# EAGLE schematic relay (EAGLE 8.7.1)
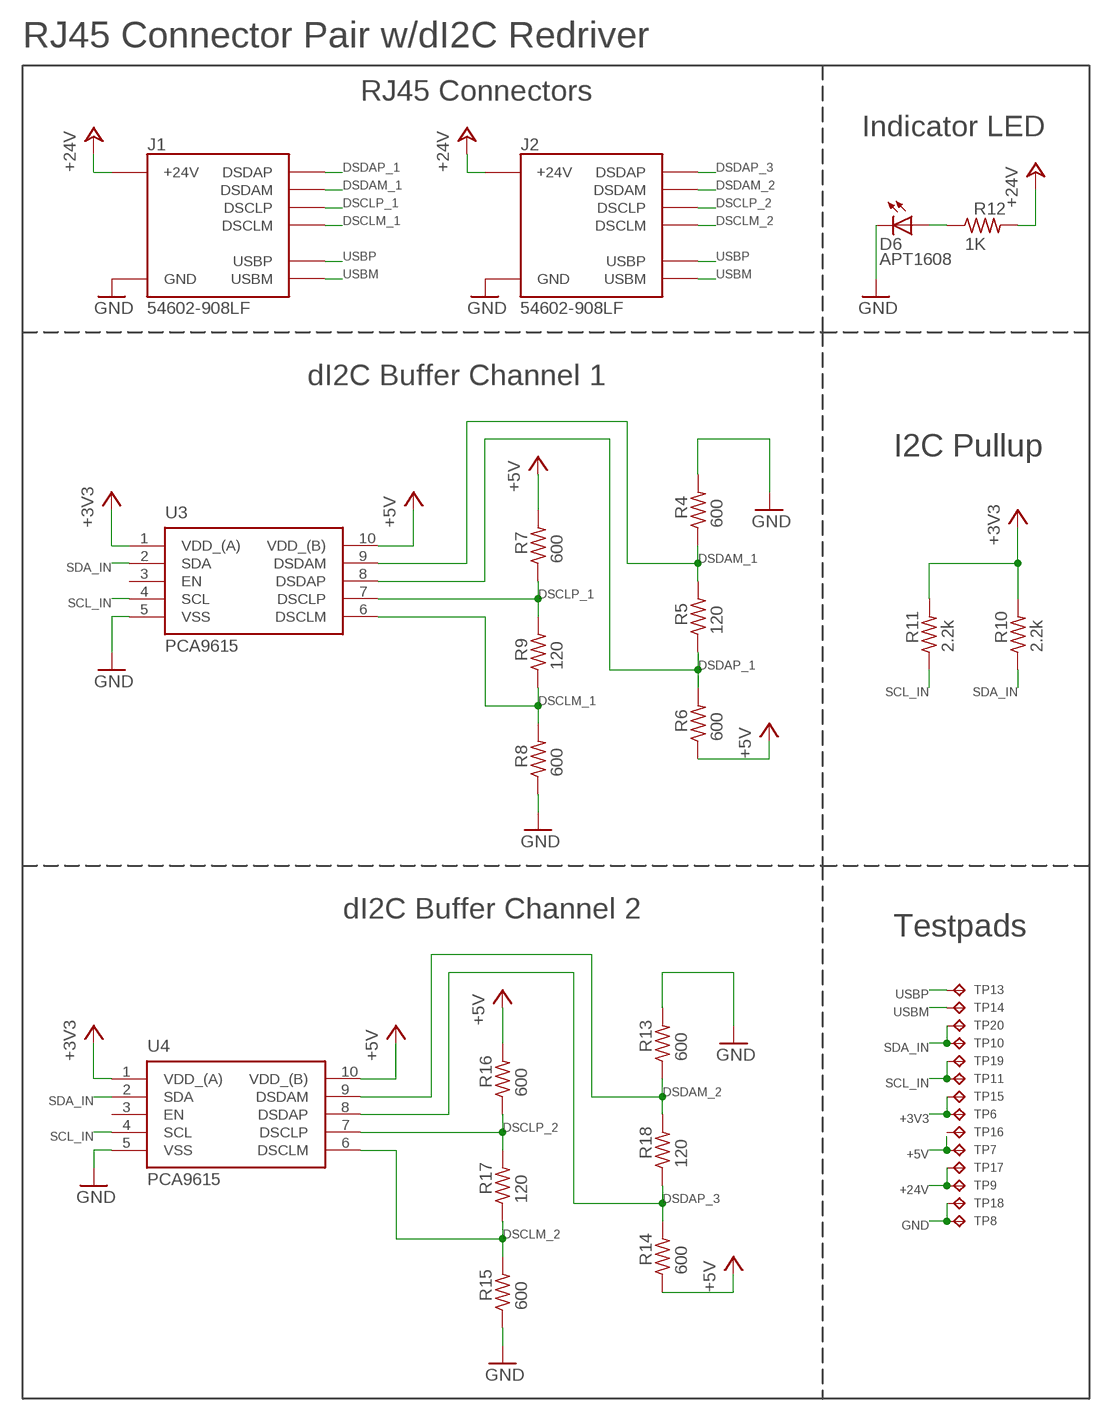
[diagram p0: schematic, sheet 1, part 1 of 2]
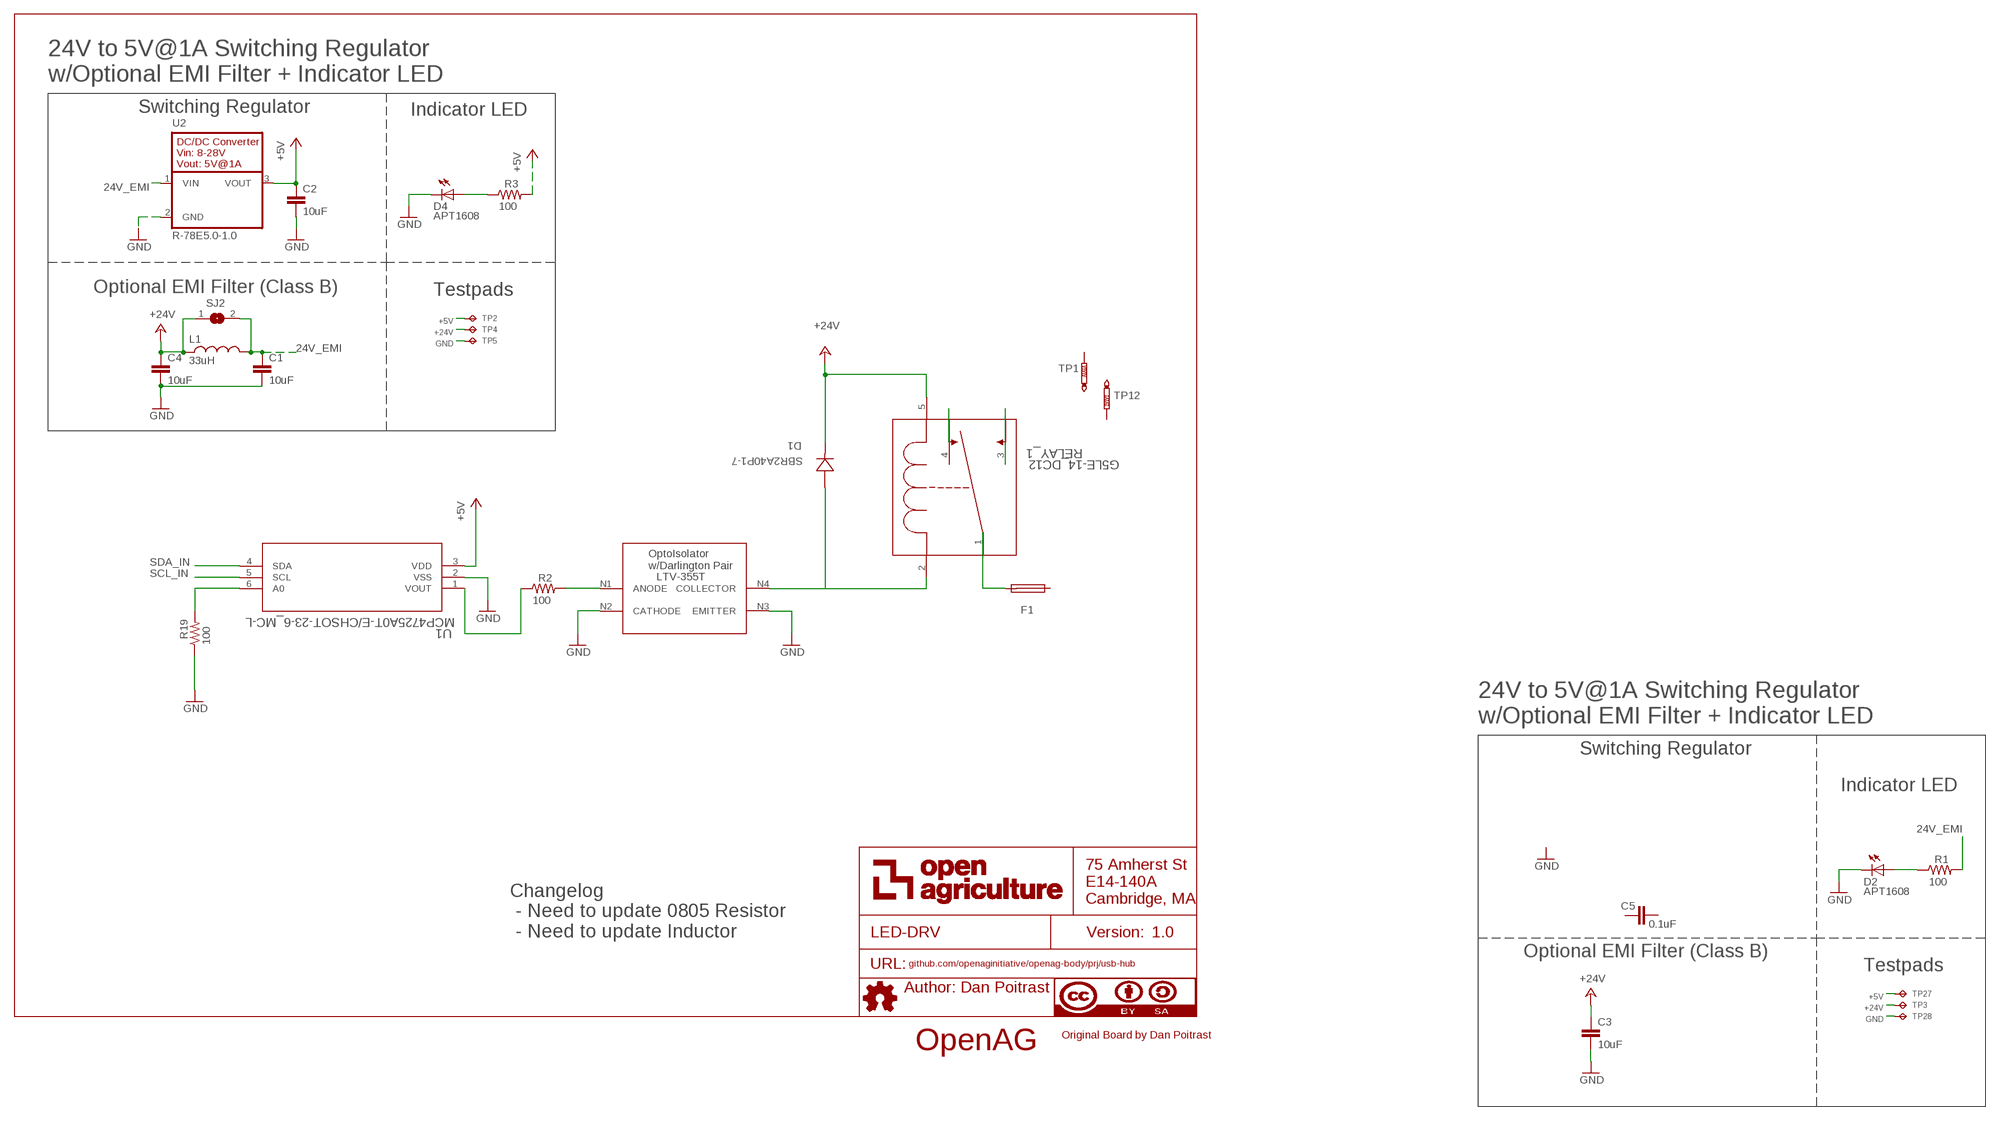
[diagram p1: schematic, sheet 1, part 2 of 2]

## Parts
C1  10uF  10UF-GMK212BBJ106KG-T  [C0805]
C2  10uF  10UF-GMK212BBJ106KG-T  [C0805]
C3  10uF  10UF-GMK212BBJ106KG-T  [C0805]
C4  10uF  10UF-GMK212BBJ106KG-T  [C0805]
C5  0.1uF  0.1UF-C0603C104K5RACTU  [C0603]
D1  SBR2A40P1-7  [POWERDI123]
D2  APT1608  APT1608CGCK  [CHIPLED_0603]
D4  APT1608  APT1608CGCK  [CHIPLED_0603]
D6  APT1608  APT1608CGCK  [CHIPLED_0603]
F1  GSH15  [GSH15]
J1  54602-908LF  RJ45-DI2C-USB-54602-908LFPTH  [RJ45-DI2C-USB-54602-908LF]
J2  54602-908LF  RJ45-DI2C-USB-54602-908LFPTH  [RJ45-DI2C-USB-54602-908LF]
L1  33uH  33UH-29333C  [29333C]
R1  100  100OHM-RC0603JR-07100RL  [RC0603N]
R2  100  100OHM-RC0603JR-07100RL  [RC0603N]
R3  100  100OHM-RC0603JR-07100RL  [RC0603N]
R4  600  600OHM-RC0603FR-07604RL  [RC0603N]
R5  120  120OHM-RC0603FR-07120RL  [RC0603N]
R6  600  600OHM-RC0603FR-07604RL  [RC0603N]
R7  600  600OHM-RC0603FR-07604RL  [RC0603N]
R8  600  600OHM-RC0603FR-07604RL  [RC0603N]
R9  120  120OHM-RC0603FR-07120RL  [RC0603N]
R10  2.2k  2.2K-RC0603JR-072K2L  [RC0603N]
R11  2.2k  2.2K-RC0603JR-072K2L  [RC0603N]
R12  1K  1K-ERJ-PB3D1001V  [RC0603N]
R13  600  600OHM-RC0603FR-07604RL  [RC0603N]
R14  600  600OHM-RC0603FR-07604RL  [RC0603N]
R15  600  600OHM-RC0603FR-07604RL  [RC0603N]
R16  600  600OHM-RC0603FR-07604RL  [RC0603N]
R17  120  120OHM-RC0603FR-07120RL  [RC0603N]
R18  120  120OHM-RC0603FR-07120RL  [RC0603N]
R19  100  100OHM-RC0603JR-07100RL  [RC0603N]
RELAY_1  G5LE-14_DC12  [RELAY_G5LE-1]
SJ2  EMI-BYPASS  [EMI-BYPASS]
TP1  PTR1B2,54  [B2,54]
TP2  TPTP06R  [TP06R]
TP3  TPTP06R  [TP06R]
TP4  TPTP06R  [TP06R]
TP5  TPTP06R  [TP06R]
TP6  TPTP04R  [TP04R]
TP7  TPTP04R  [TP04R]
TP8  TPTP04R  [TP04R]
TP9  TPTP04R  [TP04R]
TP10  TPTP04R  [TP04R]
TP11  TPTP04R  [TP04R]
TP12  PTR1B2,54  [B2,54]
TP13  TPTP04R  [TP04R]
TP14  TPTP04R  [TP04R]
TP15  TPTP04R  [TP04R]
TP16  TPTP04R  [TP04R]
TP17  TPTP04R  [TP04R]
TP18  TPTP04R  [TP04R]
TP19  TPTP04R  [TP04R]
TP20  TPTP04R  [TP04R]
TP27  TPTP06R  [TP06R]
TP28  TPTP06R  [TP06R]
U1  MCP4725A0T-E/CHSOT-23-6_MC-L  [SOT-23-6_MC-L]
U2  R-78E5.0-1.0  [R-78E5.0-1.0]
U3  PCA9615  PCA9615DPJ  [SOP50P490X110-10N]
U4  PCA9615  PCA9615DPJ  [SOP50P490X110-10N]
U$6  AUTHOR  [AUTHOR]
U$7  TITLE  [TITLE]
U$9  LTV-355T  [LTV-355T]

## Nets
24V_EMI: C1.1 L1.2 R1.2 SJ2.2 U2.1(VIN)
+3V3: R10.2 R11.2 TP6.1(TP) TP15.1(TP) U3.1(VDD_(A)) U4.1(VDD_(A))
+5V: C2.1 R3.2 R6.1 R7.2 R14.1 R16.2 TP2.TP TP7.1(TP) TP16.1(TP) TP27.TP U1.3(VDD) U2.3(VOUT) U3.10(VDD_(B)) U4.10(VDD_(B))
+24V: C3.1 C4.1 D1.- J1.24V(6)(+24V) J2.24V(6)(+24V) L1.1 R12.2 RELAY_1.5 SJ2.1 TP3.TP TP4.TP TP9.1(TP) TP17.1(TP)
DSCLM_1: J1.DSCLM(5)(DSCLM) R8.2 R9.1 U3.6(DSCLM)
DSCLM_2: J2.DSCLM(5)(DSCLM) R15.2 R17.1 U4.6(DSCLM)
DSCLP_1: J1.DSCLP(4)(DSCLP) R7.1 R9.2 U3.7(DSCLP)
DSCLP_2: J2.DSCLP(4)(DSCLP) R16.1 R17.2 U4.7(DSCLP)
DSDAM_1: J1.DSDAM(2)(DSDAM) R4.1 R5.2 U3.9(DSDAM)
DSDAM_2: J2.DSDAM(2)(DSDAM) R13.1 R18.2 U4.9(DSDAM)
DSDAP_1: J1.DSDAP(1)(DSDAP) R5.1 R6.2 U3.8(DSDAP)
DSDAP_3: J2.DSDAP(1)(DSDAP) R14.2 R18.1 U4.8(DSDAP)
GND: C1.2 C2.2 C3.2 C4.2 D2.C D4.C D6.C R4.2 R8.1 R13.2 R15.1 R19.1 TP5.TP TP8.1(TP) TP18.1(TP) TP28.TP U1.2(VSS) U2.2(GND) U3.5(VSS) U4.5(VSS) U$9.N2(CATHODE) U$9.N3(EMITTER)
N$4: RELAY_1.3
N$5: D1.+ RELAY_1.2 U$9.N4(COLLECTOR)
N$6: D2.A R1.1
N$11: F1.2 RELAY_1.1
N$27: R2.2 U$9.N1(ANODE)
N$31: R2.1 U1.1(VOUT)
N$32: R19.2 U1.6(A0)
N$33: D4.A R3.1
N$43: D6.A R12.1
SCL_IN: R11.1 TP11.1(TP) TP19.1(TP) U1.5(SCL) U3.4(SCL) U4.4(SCL)
SDA_IN: R10.1 TP10.1(TP) TP20.1(TP) U1.4(SDA) U3.2(SDA) U4.2(SDA)
USBM: J1.USBM(8)(USBM) J2.USBM(8)(USBM) TP14.1(TP)
USBP: J1.USBP(7)(USBP) J2.USBP(7)(USBP) TP13.1(TP)
Unconnected: C5.1 C5.2 F1.1 J1.GND(3)(GND) J2.GND(3)(GND) RELAY_1.4 TP1.TP TP12.TP U3.3(EN) U4.3(EN)

## Notes on the sheet
- 24V to 5V@1A Switching Regulator
  w/Optional EMI Filter + Indicator LED
- RJ45 Connector Pair w/dI2C Redriver
- Switching Regulator | Indicator LED
- RJ45 Connectors
- Indicator LED
- Optional EMI Filter (Class B) | Testpads
- dI2C Buffer Channel 1
- I2C Pullup
- LTV-355T
- dI2C Buffer Channel 2
- Testpads
- 24V to 5V@1A Switching Regulator
  w/Optional EMI Filter + Indicator LED
- Switching Regulator
- Indicator LED
- Changelog
   - Need to update 0805 Resistor
   - Need to update Inductor
- Optional EMI Filter (Class B)
- Testpads
- Original Board by Dan Poitrast
- OpenAG

## Library data of the parts
C1-C4 = openag-capacitors:10UF-GMK212BBJ106KG-T: CAP CER 10UF 35V X5R 0805 Description: 10µF ±10% 35V Ceramic Capacitor X5R 0805 (2012 Metric) Technical Specifications: Capacitance: 10µF Tolerance: ±10% Rated Voltage: 35V Temperature Coefficient: X5R Operating Temperature: -55°C ~ 85°C Package / Case: 0805 (2012 Metric) Datasheet(s): GMK212BBJ106KG-T Spec <http://ds.yuden.co.jp/TYCOMPAS/ut/detail.do?productNo=GMK212BBJ106KG-T&fileName=GMK212BBJ106KG-T_SS&mode=specSheetDownload> Vendor(s): Digikey: 587-4893-1-ND <https://www.digikey.com/product-detail/en/taiyo-yuden/GMK212BBJ106KG-T/587-4893-1-ND/6563736>; MANUFACTURER: Taiyo Yuden; MPN: GMK212BBJ106KG-T; VENDOR: Digikey; VLINK: https://www.digikey.com/product-detail/en/taiyo-yuden/GMK212BBJ106KG-T/587-4893-1-ND/6563736; VPN: 587-4893-1-ND
C5 = openag-capacitors:0.1UF-C0603C104K5RACTU: CAP CER 0.1UF 50V X7R 0603 Description: 0.1µF ±10% 50V Ceramic Capacitor X7R 0603 (1608 Metric) Technical Specifications: Capacitance: 0.1µF Tolerance: ±10% Rated Voltage: 50V Temperature Coefficient: X7R Operating Temperature: -55°C ~ 125°C Package / Case: 0603 (1608 Metric) Datasheet(s): X7R Dielectric, 6.3-250 VDC <https://search.kemet.com/component-edge/download/datasheet/C0603C104K5RACTU.pdf> Vendor(s): Digikey: 399-5089-1-ND <https://www.digikey.com/product-detail/en/kemet/C0603C104K5RACTU/399-5089-1-ND/1465623>; MANUFACTURER: Kemet; MPN: C0603C104K5RACTU; VENDOR: Digikey; VLINK: https://www.digikey.com/product-detail/en/kemet/C0603C104K5RACTU/399-5089-1-ND/1465623; VPN: 399-5089-1-ND
D1 = openag-diodes:SBR2A40P1-7: DIODE SBR 40V 2A POWERDI123 Description: Diode Super Barrier 40V 2A Surface Mount PowerDI™ 123 Technical Specifications: Diode Type: Super Barrier Voltage - DC Reverse (Vr) (Max): 40V Current - Average Rectified (Io): 2A Voltage - Forward (Vf) (Max) @ If: 500mV @ 2A Speed: Standard Recovery >500ns, > 200mA (Io) Current - Reverse Leakage @ Vr: 100µA @ 40V Mounting Type: Surface Mount Package / Case: POWERDI®123 Supplier Device Package: PowerDI™ 123 Operating Temperature - Junction: -65°C ~ 150°C Base Part Number: SBR2A40 Datasheet(s): SBR2A40P1 <https://www.diodes.com/assets/Datasheets/SBR2A40P1.pdf> Vendor(s): Digikey: SBR2A40P1DITR-ND <https://www.digikey.com/product-detail/en/diodes-incorporated/SBR2A40P1-7/SBR2A40P1DITR-ND/1681825>; MANUFACTURER: Diodes Incorporated; MPN: SBR2A40P1-7; VENDOR: Digikey; VLINK: https://www.digikey.com/product-detail/en/diodes-incorporated/SBR2A40P1-7/SBR2A40P1DITR-ND/1681825; VPN: SBR2A40P1DITR-ND
D2 D4 D6 = openag-diodes:APT1608CGCK: LED GREEN CLEAR 0603 SMD Description: Green 570nm LED Indication - Discrete 2.1V 0603 (1608 Metric) Technical Specifications: Color: Green Lens Color: Colorless Lens Transparency: Clear Millicandela Rating: 50mcd Lens Style/Size: Rectangle with Flat Top, 1.20mm x 0.80mm Voltage - Forward (Vf) (Typ): 2.1V Current - Test: 20mA Viewing Angle: 120° Mounting Type: Surface Mount Wavelength - Dominant: 570nm Wavelength - Peak: 574nm Package / Case: 0603 (1608 Metric) Supplier Device Package: Chip LED Size / Dimension: 1.60mm L x 0.80mm W Height (Max): 0.75mm Datasheet(s): APT1608CGCK <http://www.kingbrightusa.com/images/catalog/SPEC/APT1608CGCK.pdf> Vendor(s): Digikey: 754-1116-1-ND <https://www.digikey.com/product-detail/en/kingbright/APT1608CGCK/754-1116-1-ND/1747833#>; MANUFACTURER: Kingbright; MPN: APT1608CGCK; VENDOR: Digikey; VLINK: https://www.digikey.com/product-detail/en/kingbright/APT1608CGCK/754-1116-1-ND/1747833#; VPN: 754-1116-1-ND
F1 = fuse:GSH15: FUSE HOLDER grid 15mm, 19649 Wickmann; MPN: 64900001039; OC_FARNELL: 1271673; OC_NEWARK: 02P0318
J1 J2 = openag-connectors:RJ45-DI2C-USB-54602-908LF: CONN MOD JACK 8P8C R/A UNSHLD Description: Jack Modular Connector 8p8c (RJ45, Ethernet) 90° Angle (Right) Unshielded Cat3 Technical Specifications: Connector Type: Jack Number of Positions/Contacts: 8p8c (RJ45, Ethernet) Number of Ports: 1 Number of Rows: 1 Mounting Type: Through Hole Orientation: 90° Angle (Right) Termination: Solder Shielding: Unshielded Ratings: Cat3 Features: Board Lock LED Color: Does Not Contain LED Tab Direction: Down Contact Material: Copper Alloy Contact Finish: Gold Contact Finish Thickness: 15µin (0.38µm) Housing Material: Polyester, Glass Filled Operating Temperature: -40°C ~ 70°C Datasheet(s): 54601-x04(zzz)WPLF Drawing <http://cdn.amphenol-icc.com/media/wysiwyg/files/drawing/c-bmj-0102.pdf> Vendor(s): Digikey: 609-1046-ND <https://www.digikey.com/product-detail/en/amphenol-fci/54602-908LF/609-1046-ND/1001360>; MANUFACTURER: Amphenol FCI; MPN: 54602-908LF; VENDOR: Digikey; VLINK: https://www.digikey.com/product-detail/en/amphenol-fci/54602-908LF/609-1046-ND/1001360; VPN: 609-1046-ND
L1 = openag-inductors:33UH-29333C: FIXED IND 33UH 1A 120 MOHM SMD Description: 33µH Shielded Wirewound Inductor 1A 120 mOhm Max Nonstandard Technical Specifications: Type: Wirewound Inductance: 33µH Current Rating: 1A Shielding: Shielded DC Resistance (DCR): 120 mOhm Max Operating Temperature: -40°C ~ 85°C Frequency - Test: 10kHz Mounting Type: Surface Mount Package / Case: Nonstandard Size / Dimension: 0.283" L x 0.283" W (7.20mm x 7.20mm) Height - Seated (Max): 0.157" (4.00mm) Datasheet(s): 2900 Series <https://www.murata-ps.com/data/magnetics/kmp_2900.pdf> Vendor(s): Digikey: 811-1138-1-ND <https://www.digikey.com/product-detail/en/murata-power-solutions-inc/29333C/811-1138-1-ND/1924860>; MANUFACTURER: Murata Power Solutions Inc.; MPN: 29333C; VENDOR: Digikey; VLINK: https://www.digikey.com/product-detail/en/murata-power-solutions-inc/29333C/811-1138-1-ND/1924860; VPN: 811-1138-1-ND
R1-R3 R19 = openag-resistors:100OHM-RC0603JR-07100RL: RES SMD 100 OHM 5% 1/10W 0603 Description: 100 Ohms ±5% 0.1W, 1/10W Chip Resistor 0603 (1608 Metric) Moisture Resistant Thick Film Technical Specifications: Resistance: 100 Ohms Tolerance: ±5% Power (Watts): 0.1W, 1/10W Composition: Thick Film Features: Moisture Resistant Temperature Coefficient: ±100ppm/°C Operating Temperature: -55°C ~ 155°C Package / Case: 0603 (1608 Metric) Supplier Device Package: 0603 Size / Dimension: 0.063" L x 0.032" W (1.60mm x 0.80mm) Height - Seated (Max): 0.022" (0.55mm) Number of Terminations: 2 Datasheet(s): Thick Film Chip Resistor Intro <http://www.yageo.com.tw/exep/pages/download/literatures/PYu-R_INT-thick_7.pdf> Chip Resistor Marking <http://www.yageo.com/exep/pages/download/literatures/PYu-R_Marking_2.pdf> RC Series, L Datasheet <http://www.yageo.com/documents/recent/PYu-RC_Group_51_RoHS_L_8.pdf> Vendor(s): Digikey: 311-100GRCT-ND <https://www.digikey.com/product-detail/en/yageo/RC0603JR-07100RL/311-100GRCT-ND/729644>; MANUFACTURER: Yageo; MPN: RC0603JR-07100RL; VENDOR: Digikey; VLINK: https://www.digikey.com/product-detail/en/yageo/RC0603JR-07100RL/311-100GRCT-ND/729644; VPN: 311-100GRCT-ND
R4 R6-R8 R13-R16 = openag-resistors:600OHM-RC0603FR-07604RL: RES SMD 604 OHM 1% 1/10W 0603 Description: 604 Ohms ±1% 0.1W, 1/10W Chip Resistor 0603 (1608 Metric) Moisture Resistant Thick Film Technical Specifications: Resistance: 604 Ohms Tolerance: ±1% Power (Watts): 0.1W, 1/10W Composition: Thick Film Features: Moisture Resistant Temperature Coefficient: ±100ppm/°C Operating Temperature: -55°C ~ 155°C Package / Case: 0603 (1608 Metric) Supplier Device Package: 0603 Size / Dimension: 0.063" L x 0.032" W (1.60mm x 0.80mm) Height - Seated (Max): 0.022" (0.55mm) Number of Terminations: 2 Datasheet(s): RC Series, L Datasheet <http://www.yageo.com/documents/recent/PYu-RC_Group_51_RoHS_L_8.pdf> Chip Resistor Marking <http://www.yageo.com/exep/pages/download/literatures/PYu-R_Marking_2.pdf> Vendor(s): Digikey: 311-604HRCT-ND <https://www.digikey.com/product-detail/en/yageo/RC0603FR-07604RL/311-604HRCT-ND/730276>; MANUFACTURER: Yageo; MPN: RC0603FR-07604RL; VENDOR: Digikey; VLINK: https://www.digikey.com/product-detail/en/yageo/RC0603FR-07604RL/311-604HRCT-ND/730276; VPN: 311-604HRCT-ND
R5 R9 R17 R18 = openag-resistors:120OHM-RC0603FR-07120RL: RES SMD 120 OHM 1% 1/10W 0603 Description: 120 Ohms ±1% 0.1W, 1/10W Chip Resistor 0603 (1608 Metric) Moisture Resistant Thick Film Technical Specifications: Resistance: 120 Ohms Tolerance: ±1% Power (Watts): 0.1W, 1/10W Composition: Thick Film Features: Moisture Resistant Temperature Coefficient: ±100ppm/°C Operating Temperature: -55°C ~ 155°C Package / Case: 0603 (1608 Metric) Supplier Device Package: 0603 Size / Dimension: 0.063" L x 0.032" W (1.60mm x 0.80mm) Height - Seated (Max): 0.022" (0.55mm) Number of Terminations: 2 Datasheet(s): RC Series, L Datasheet <http://www.yageo.com/documents/recent/PYu-RC_Group_51_RoHS_L_8.pdf> Chip Resistor Marking <http://www.yageo.com/exep/pages/download/literatures/PYu-R_Marking_2.pdf> Vendor(s): Digikey: 311-120HRCT-ND <https://www.digikey.com/product-detail/en/yageo/RC0603FR-07120RL/311-120HRCT-ND/729867>; MANUFACTURER: Yageo; MPN: RC0603FR-07120RL; VENDOR: Digikey; VLINK: https://www.digikey.com/product-detail/en/yageo/RC0603FR-07120RL/311-120HRCT-ND/729867; VPN: 311-120HRCT-ND
R10 R11 = openag-resistors:2.2K-RC0603JR-072K2L: RES SMD 2.2K OHM 5% 1/10W 0603 Description: 2.2 kOhms ±5% 0.1W, 1/10W Chip Resistor 0603 (1608 Metric) Moisture Resistant Thick Film Technical Specifications: Resistance: 2.2 kOhms Tolerance: ±5% Power (Watts): 0.1W, 1/10W Composition: Thick Film Features: Moisture Resistant Temperature Coefficient: ±100ppm/°C Operating Temperature: -55°C ~ 155°C Package / Case: 0603 (1608 Metric) Supplier Device Package: 0603 Size / Dimension: 0.063" L x 0.032" W (1.60mm x 0.80mm) Height - Seated (Max): 0.022" (0.55mm) Number of Terminations: 2 Datasheet(s): RC Series, L Datasheet <http://www.yageo.com/documents/recent/PYu-RC_Group_51_RoHS_L_8.pdf> Chip Resistor Marking <http://www.yageo.com/exep/pages/download/literatures/PYu-R_Marking_2.pdf> Vendor(s): Digikey: 311-2.2KGRCT-ND <https://www.digikey.com/product-detail/en/yageo/RC0603JR-072K2L/311-2.2KGRCT-ND/729676#>; MANUFACTURER: Yageo; MPN: RC0603JR-072K2L; VENDOR: Digikey; VLINK: https://www.digikey.com/product-detail/en/yageo/RC0603JR-072K2L/311-2.2KGRCT-ND/729676#; VPN: 311-2.2KGRCT-ND
R12 = openag-resistors:1K-ERJ-PB3D1001V: RES SMD 1K OHM 0.5% 1/5W 0603 Description: 1 kOhms ±0.5% 0.2W, 1/5W Chip Resistor 0603 (1608 Metric) Automotive AEC-Q200, Pulse Withstanding Thick Film Technical Specifications: Resistance: 1 kOhms Tolerance: ±0.5% Power: 0.2W, 1/5W Operating Temperature: -55°C ~ 155°C Package / Case: 0603 (1608 Metric) Datasheet(s): ERJ-PB3, PB6 Series, High Precision Datasheet <https://industrial.panasonic.com/cdbs/www-data/pdf/RDM0000/AOA0000C328.pdf> Vendor(s): Digikey: P20283CT-ND <https://www.digikey.com/product-detail/en/panasonic-electronic-components/ERJ-PB3D1001V/P20283CT-ND/6214538>; MANUFACTURER: Panasonic; MPN: P20283CT-ND; VENDOR: Digikey; VLINK: https://www.digikey.com/product-detail/en/panasonic-electronic-components/ERJ-PB3D1001V/P20283CT-ND/6214538; VPN: P20283CT-ND
RELAY_1 = relay_2:G5LE-14_DC12; MANUFACTURER_PART_NUMBER: G5LE14 DC12; VENDOR: OMRON
SJ2 = openag-connectors:EMI-BYPASS: EMI Bypass Solder Jumper; MPN: N/A
TP1 TP12 = testpad:PTR1: TEST PIN
TP2-TP11 TP13-TP20 TP27 TP28 = openag-testpads:TP: Test pad; MPN: N/A
U1 = openag-dacs:MCP4725A0T-E/CH; MANUFACTURER_PART_NUMBER: MCP4725A0TECH; VENDOR: Microchip
U2 = openag-regulators:R-78E5.0-1.0: DC/DC CONVERTER 5V 5W Description: Linear Regulator Replacement DC DC Converter 1 Output 5V 1A 8V - 28V Input Technical Specifications: Type: Linear Regulator Replacement Number of Outputs: 1 Voltage - Input (Min): 8V Voltage - Input (Max): 28V Voltage - Output 1: 5V Current - Output (Max): 1A Power (Watts): 5W Applications: ITE (Commercial) Features: SCP Operating Temperature: -40°C ~ 85°C Efficiency: 91% Mounting Type: Through Hole Package / Case: 3-SIP Module Size / Dimension: 0.46" L x 0.33" W x 0.41" H (11.6mm x 8.5mm x 10.4mm) Datasheet(s): R-78E-1.0 Series Datasheet <https://www.recom-power.com/pdf/Innoline/R-78Exx-1.0.pdf> Vendor(s): Digikey: 945-2201-ND <https://www.digikey.com/product-detail/en/recom-power/R-78E5.0-1.0/945-2201-ND/4930585>; MANUFACTURER: Recom Power; MPN: R-78E5.0-1.0; VENDOR: Digikey; VLINK: https://www.digikey.com/product-detail/en/recom-power/R-78E5.0-1.0/945-2201-ND/4930585; VPN: 945-2201-ND
U3 U4 = openag-buffers:PCA9615DPJ: IC REDRIVER I2C 2CH 10TSSOP Description: Buffer, ReDriver 2 Channel 400kHz 10-TSSOP Technical Specifications: Type: Buffer, ReDriver Applications: I²C Input: 2-Wire Bus Output: 2-Wire Bus Data Rate (Max): 400kHz Number of Channels: 2 Capacitance - Input: 7pF Voltage - Supply: 2.3 V ~ 5.5 V Current - Supply: 16µA Operating Temperature: -40°C ~ 85°C Package / Case: 10-TFSOP, 10-MSOP (0.118", 3.00mm Width) Supplier Device Package: 10-TSSOP Base Part Number: PCA9615 Datasheet(s): PCA9615DP <http://www.nxp.com/documents/data_sheet/PCA9615.pdf> Vendor(s): Digikey: 568-11484-1-ND <https://www.digikey.com/product-detail/en/nxp-usa-inc/PCA9615DPJ/568-11484-1-ND/4864508>; MANUFACTURER: NXP USA Inc.; MPN: PCA9615DPJ; VENDOR: Digikey; VLINK: https://www.digikey.com/product-detail/en/nxp-usa-inc/PCA9615DPJ/568-11484-1-ND/4864508; VPN: 568-11484-1-ND
U$6 = openag-frames:AUTHOR; AUTHOR: Dan Poitrast; MPN: N/A
U$7 = openag-frames:TITLE; MPN: N/A; TITLE: LED-DRV; URL: github.com/openaginitiative/openag-body/prj/usb-hub; VER: 1.0
U$9 = openag-transistors:LTV-355T